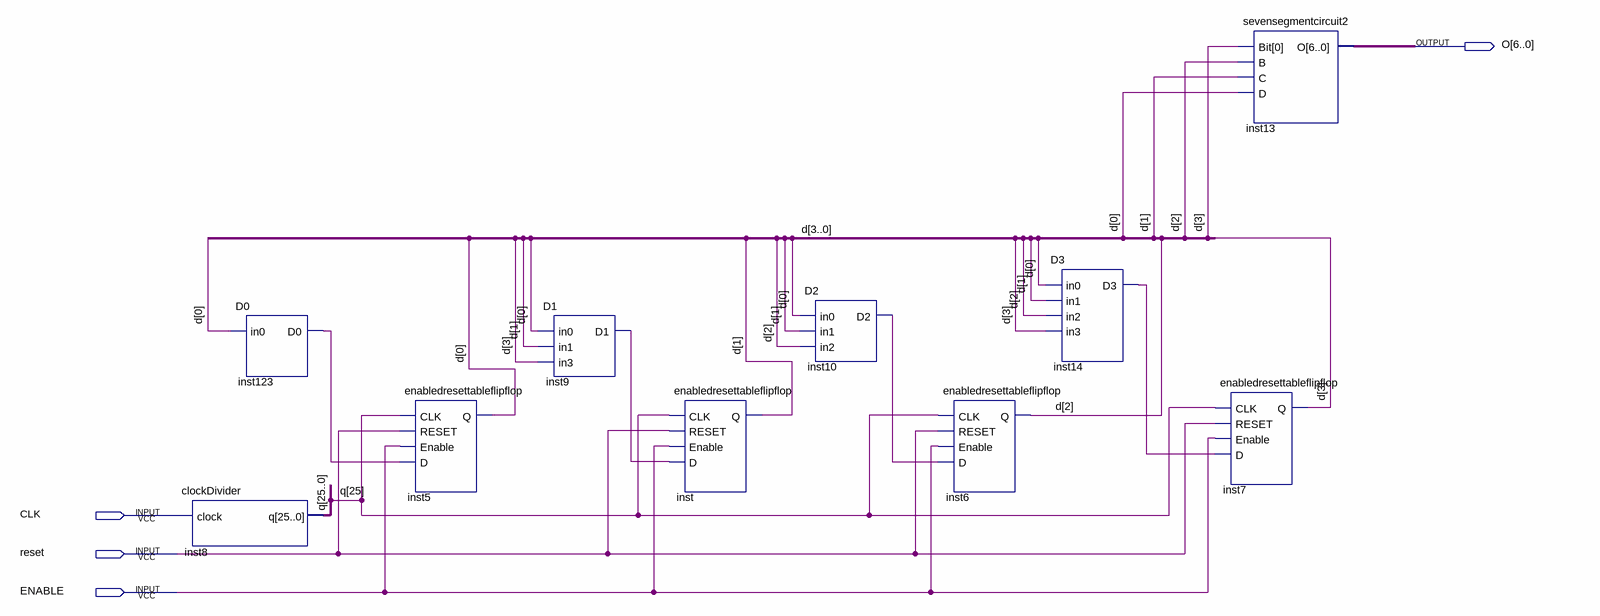
[diagram p0: schematic sheet]
// Quartus schematic counter.bdf as structural Verilog: 10 symbols, 4 pins
module counter (
  input  CLK,
  input  reset,
  input  ENABLE,
  output [6:0] O
);

  wire inst9_d1, inst10_d2, inst14_d3, inst123_d0;
  wire [3:0] d;
  wire [25:0] q;

  clockDivider inst8 (.clock(CLK), .q(q));
  D0 inst123 (.in0(d[0]), .D0(inst123_d0));
  enabledresettableflipflop inst5 (.CLK(q[25]), .RESET(reset), .Enable(ENABLE), .D(inst123_d0), .Q(d[0]));
  D1 inst9 (.in0(d[0]), .in1(d[1]), .in3(d[3]), .D1(inst9_d1));
  enabledresettableflipflop inst (.CLK(q[25]), .RESET(reset), .Enable(ENABLE), .D(inst9_d1), .Q(d[1]));
  D2 inst10 (.in0(d[0]), .in1(d[1]), .in2(d[2]), .D2(inst10_d2));
  enabledresettableflipflop inst6 (.CLK(q[25]), .RESET(reset), .Enable(ENABLE), .D(inst10_d2), .Q(d[2]));
  D3 inst14 (.in0(d[0]), .in1(d[1]), .in2(d[2]), .in3(d[3]), .D3(inst14_d3));
  sevensegmentcircuit2 inst13 (.Bit(d[3]), .B(d[2]), .C(d[1]), .D(d[0]), .O(O));
  enabledresettableflipflop inst7 (.CLK(q[25]), .RESET(reset), .Enable(ENABLE), .D(inst14_d3), .Q(d[3]));
endmodule
